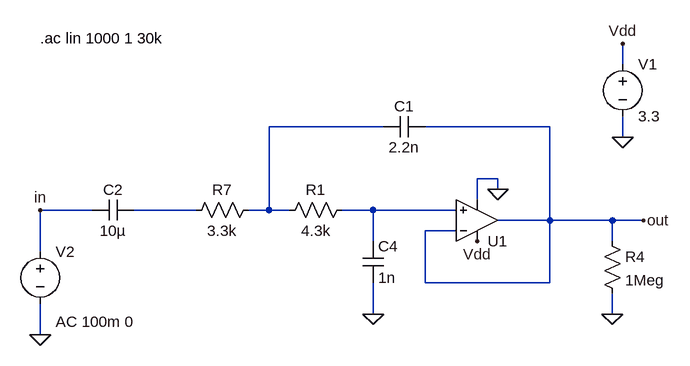
[diagram p0: schematic output filter.asc]
output filter.asc, the LTspice schematic file:
Version 4
SHEET 1 880 680
WIRE 336 -96 336 -128
WIRE -32 0 -208 0
WIRE 224 0 32 0
WIRE 336 16 336 -16
WIRE 144 80 112 80
WIRE 144 96 144 80
WIRE 112 112 112 80
WIRE -480 128 -560 128
WIRE -320 128 -416 128
WIRE -208 128 -208 0
WIRE -208 128 -240 128
WIRE -176 128 -208 128
WIRE -48 128 -96 128
WIRE 80 128 -48 128
WIRE 224 144 224 0
WIRE 224 144 144 144
WIRE 320 144 224 144
WIRE 368 144 320 144
WIRE 80 160 32 160
WIRE -48 176 -48 128
WIRE 320 176 320 144
WIRE -560 192 -560 128
WIRE 32 240 32 160
WIRE 224 240 224 144
WIRE 224 240 32 240
WIRE -48 288 -48 240
WIRE 320 288 320 256
WIRE -560 320 -560 272
FLAG 320 288 0
FLAG 336 16 0
FLAG 336 -128 Vdd
FLAG 144 96 0
FLAG 112 176 Vdd
FLAG 368 144 out
FLAG -560 320 0
FLAG -48 288 0
FLAG -560 128 in
SYMBOL Opamps\\UniversalOpamp2 112 144 M180
SYMATTR InstName U1
SYMBOL cap -416 112 R90
WINDOW 0 0 32 VBottom 2
WINDOW 3 32 32 VTop 2
SYMATTR InstName C2
SYMATTR Value 10µ
SYMBOL res 304 160 R0
SYMATTR InstName R4
SYMATTR Value 1Meg
SYMBOL voltage 336 -112 R0
WINDOW 123 0 0 Left 0
WINDOW 39 0 0 Left 0
SYMATTR InstName V1
SYMATTR Value 3.3
SYMBOL voltage -560 176 R0
WINDOW 123 24 124 Left 2
WINDOW 39 0 0 Left 0
SYMATTR Value2 AC 100m 0
SYMATTR InstName V2
SYMATTR Value ""
SYMBOL cap 32 -16 R90
WINDOW 0 0 32 VBottom 2
WINDOW 3 32 32 VTop 2
SYMATTR InstName C1
SYMATTR Value 2.2n
SYMBOL cap -64 176 R0
SYMATTR InstName C4
SYMATTR Value 1n
SYMBOL res -80 112 R90
WINDOW 0 0 56 VBottom 2
WINDOW 3 32 56 VTop 2
SYMATTR InstName R1
SYMATTR Value 4.3k
SYMBOL res -224 112 R90
WINDOW 0 0 56 VBottom 2
WINDOW 3 32 56 VTop 2
SYMATTR InstName R7
SYMATTR Value 3.3k
TEXT -560 -136 Left 2 !.ac lin 1000 1 30k

The netlist it stands for:
* output filter.asc
XU1 N003 out Vdd 0 out level.2 Avol=1Meg GBW=10Meg Slew=10Meg ilimit=25m rail=0 Vos=0 phimargin=45 en=0 enk=0 in=0 ink=0 Rin=500Meg  ; pins IN+ IN- V+ V- OUT
C2 N002 in 10µ
R4 out 0 1Meg
V1 Vdd 0 3.3
V2 in 0 AC 100m 0
C1 out N001 2.2n
C4 N003 0 1n
R1 N003 N001 4.3k
R7 N001 N002 3.3k
.ac lin 1000 1 30k
.lib UniversalOpamps2.sub
.backanno
.end